# Altium schematic sheet MAZ000186 - Diagrama físico.SchDoc: MAZ000186 - Diagrama físico
size A; ApprovedBy: Christian Ledwidth; CheckedBy: Nahuel Martinez; Author: Santiago Marti; CompanyName: Body Health; DrawnBy: Santiago Marti; Revision: A; SheetNumber: 2; SheetTotal: 2
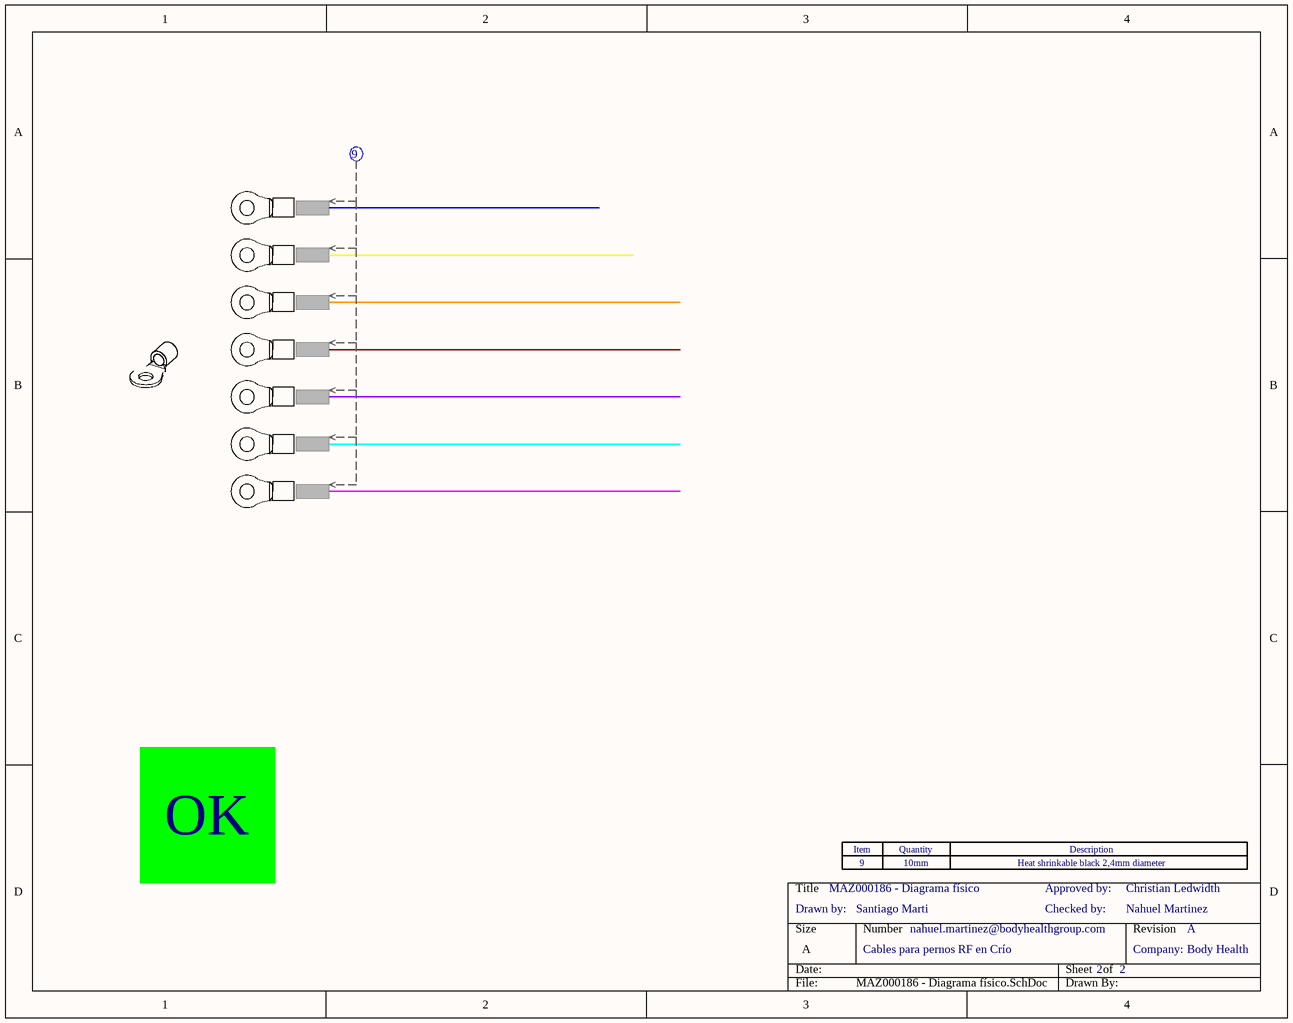
[diagram p0: MAZ000186 - Diagrama físico.SchDoc]

## Parts
(Parts that share a designator on the sheet are numbered #1, #2 ... from top to bottom, then left to right.)
Con?#1  Ring  (value not drawn)  (part A of 4)
Con?#2  Ring  (value not drawn)  (part A of 4)
Con?#3  Ring  (value not drawn)  (part A of 4)
Con?#4  Ring  (value not drawn)  (part A of 4)
Con?#5  Ring  (value not drawn)  (part B of 4)
Con?#6  Ring  (value not drawn)  (part A of 4)
Con?#7  Ring  (value not drawn)  (part A of 4)
Con?#8  Ring  (value not drawn)  (part A of 4)
Ter?  Termocontraible  (value not drawn)
Zoc?#1  Zócalo_Header  (value not drawn)
Zoc?#2  Zócalo_Item  (value not drawn)

## Notes on the sheet
- OK
- (near Zoc?#2) Drawn by:
- (near Zoc?#1) 9
- 10mm
- Checked by:
- Approved by:
- Heat shrinkable black 2,4mm diameter
- Cables para pernos RF en Crío
- nahuel.martinez@bodyhealthgroup.com
- Company:
- (in symbol Zócalo_Header) Item; Quantity; Description

## Library data of the parts
Con?#1-Con?#8 = Ring: CONN HOUSING RING M4; Cod.DigiKey: -; Cod.Fabricante: -; ComponentLink1Description: Manufacturer Link; ComponentLink1URL: -; DIGIKEYx50: -; Fabricante: -; CallOut: *; DIGIKEYx100: -
Ter? = Termocontraible: CallOut: 9; Largo: *; Diámetro: *
Zoc?#1 = Zócalo_Header: Header para el zócalo de referencias
Zoc?#2 = Zócalo_Item: Ítem para el zócalo de referencias; Desginator: *; Quantity: *; ItemDescription: *